# Altium schematic sheet TopSheet.SchDoc
size 279 x 241 mm; SheetNumber: 1; SheetTotal: 8
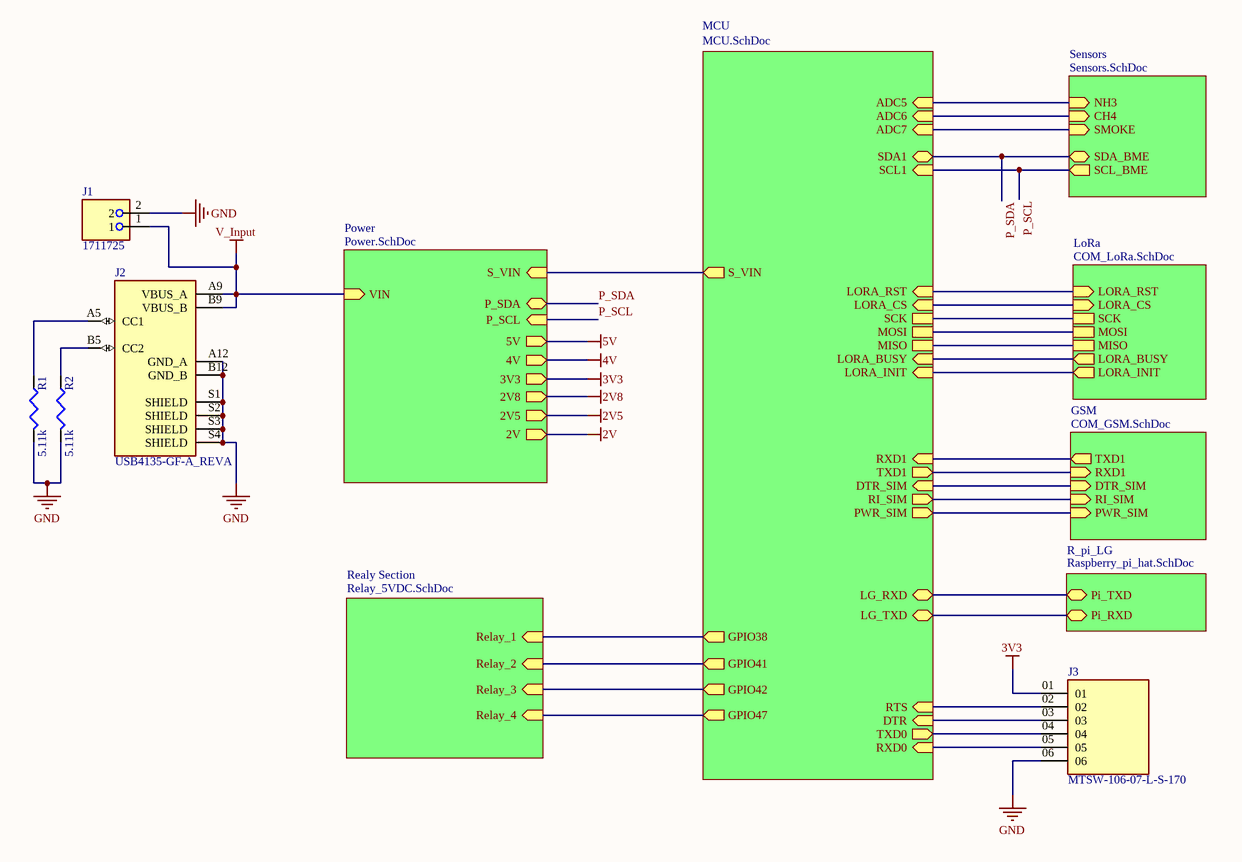
[diagram p0: TopSheet.SchDoc]

## Parts
J1  1711725  [PHOENIX_1711725]
J2  USB4135-GF-A_REVA  [GCT_USB4135-GF-A_REVA]
J3  MTSW-106-07-L-S-170  [SAMTEC_MTSW-106-07-L-S-170]
R1  5.11k  [R0603]
R2  5.11k  [R0603]

## Sub-sheets
GSM = COM_GSM.SchDoc: TXD1 (out), RXD1 (in), DTR_SIM (in), RI_SIM (in), PWR_SIM (in)
LoRa = COM_LoRa.SchDoc: LORA_RST (in), LORA_CS (in), SCK, MOSI, MISO, LORA_BUSY (out), LORA_INIT (out)
MCU = MCU.SchDoc: ADC5 (in), ADC6 (in), ADC7 (in), SDA1 (bidir), SCL1 (in), LORA_RST (in), LORA_CS (in), SCK, MOSI, MISO, LORA_BUSY (in), LORA_INIT (in), RXD1 (in), TXD1 (out), DTR_SIM (in), RI_SIM (out), PWR_SIM (out), RTS (in), DTR (in), TXD0 (out), RXD0 (in), S_VIN (out), LG_TXD (bidir), LG_RXD (bidir), GPIO38 (out), GPIO41 (out), GPIO42 (out), GPIO47 (out)
Power = Power.SchDoc: P_SDA (bidir), P_SCL (in), 5V (out), 3V3 (out), 2V5 (out), 4V (out), 2V8 (out), 2V (out), VIN (in), S_VIN (in)
R_pi_LG = Raspberry_pi_hat.SchDoc: Pi_RXD (bidir), Pi_TXD (bidir)
Realy Section = Relay_5VDC.SchDoc: Relay_1 (in), Relay_2 (in), Relay_3 (in), Relay_4 (in)
Sensors = Sensors.SchDoc: NH3 (in), CH4 (in), SMOKE (in), SDA_BME (bidir), SCL_BME (out)

## Nets
2V: sheet Power/2V
2V5: sheet Power/2V5
2V8: sheet Power/2V8
3V3: J3.01 ; sheet Power/3V3
4V: sheet Power/4V
5V: sheet Power/5V
GND: J1.2 J2.A12(GND_A) J2.B12(GND_B) J2.S1(SHIELD) J2.S2(SHIELD) J2.S3(SHIELD) J2.S4(SHIELD) J3.06 R1.2 R2.2
V_Input: J1.1 J2.A9(VBUS_A) J2.B9(VBUS_B) ; sheet Power/VIN
P_SCL: sheet MCU/SCL1, sheet Power/P_SCL, sheet Sensors/SCL_BME
P_SDA: sheet MCU/SDA1, sheet Power/P_SDA, sheet Sensors/SDA_BME
NetJ2_A5: J2.A5(CC1) R1.1
NetJ2_B5: J2.B5(CC2) R2.1
NetJ3_02: J3.02 ; sheet MCU/RTS
NetJ3_03: J3.03 ; sheet MCU/DTR
NetJ3_04: J3.04 ; sheet MCU/TXD0
NetJ3_05: J3.05 ; sheet MCU/RXD0
(unnamed): sheet MCU/ADC5, sheet Sensors/NH3
(unnamed): sheet MCU/ADC6, sheet Sensors/CH4
(unnamed): sheet MCU/ADC7, sheet Sensors/SMOKE
(unnamed): sheet MCU/LORA_RST, sheet LoRa/LORA_RST
(unnamed): sheet MCU/LORA_CS, sheet LoRa/LORA_CS
(unnamed): sheet MCU/SCK, sheet LoRa/SCK
(unnamed): sheet MCU/MOSI, sheet LoRa/MOSI
(unnamed): sheet MCU/MISO, sheet LoRa/MISO
(unnamed): sheet MCU/LORA_BUSY, sheet LoRa/LORA_BUSY
(unnamed): sheet MCU/LORA_INIT, sheet LoRa/LORA_INIT
(unnamed): sheet MCU/RXD1, sheet GSM/TXD1
(unnamed): sheet MCU/TXD1, sheet GSM/RXD1
(unnamed): sheet MCU/DTR_SIM, sheet GSM/DTR_SIM
(unnamed): sheet MCU/RI_SIM, sheet GSM/RI_SIM
(unnamed): sheet MCU/PWR_SIM, sheet GSM/PWR_SIM
(unnamed): sheet MCU/S_VIN, sheet Power/S_VIN
(unnamed): sheet MCU/LG_TXD, sheet R_pi_LG/Pi_RXD
(unnamed): sheet MCU/LG_RXD, sheet R_pi_LG/Pi_TXD
(unnamed): sheet MCU/GPIO38, sheet Realy Section/Relay_1
(unnamed): sheet MCU/GPIO41, sheet Realy Section/Relay_2
(unnamed): sheet MCU/GPIO42, sheet Realy Section/Relay_3
(unnamed): sheet MCU/GPIO47, sheet Realy Section/Relay_4

## Library data of the parts
J1 = 1711725: PCB Terminal Screw 5.08mm 12AWG 400V 24A 2 Position COMBICON MKDS Series | Phoenix Contact 1711725; SnapEDA_Link: https://www.snapeda.com/parts/1711725/Phoenix+Contact/view-part/?ref=snap; Package: None; MF: Phoenix Contact; MP: 1711725; Check_prices: https://www.snapeda.com/parts/1711725/Phoenix+Contact/view-part/?ref=eda
J2 = USB4135-GF-A_REVA: Type C Receptacle, Horizontal, SMT, For Power Charging Only; MF: Global Connector Technology; SnapEDA_Link: https://www.snapeda.com/parts/USB4135-GF-A/Global+Connector+Technology/view-part/?ref=snap; Check_prices: https://www.snapeda.com/parts/USB4135-GF-A/Global+Connector+Technology/view-part/?ref=eda; Price: None; MP: USB4135-GF-A; Value: *; Purchase-URL: https://pricing.snapeda.com/search/part/USB4135-GF-A/?ref=eda; Availability: In Stock; Package: None
R1 R2 = Resistor: This Library provides a comprehensive set of schematic symbols and PCB footprints for standard resistor packages (e.g., 0402, 0603, 0805, 1206).
J3 = MTSW-106-07-L-S-170: Availability: Unavailable; Package: None; Price: None; MP: MTSW-106-07-L-S-170